# EAGLE schematic S130050_Enclosure_WD_rev_0_1 (EAGLE 6.5.0)

## Sheet 1 of 5
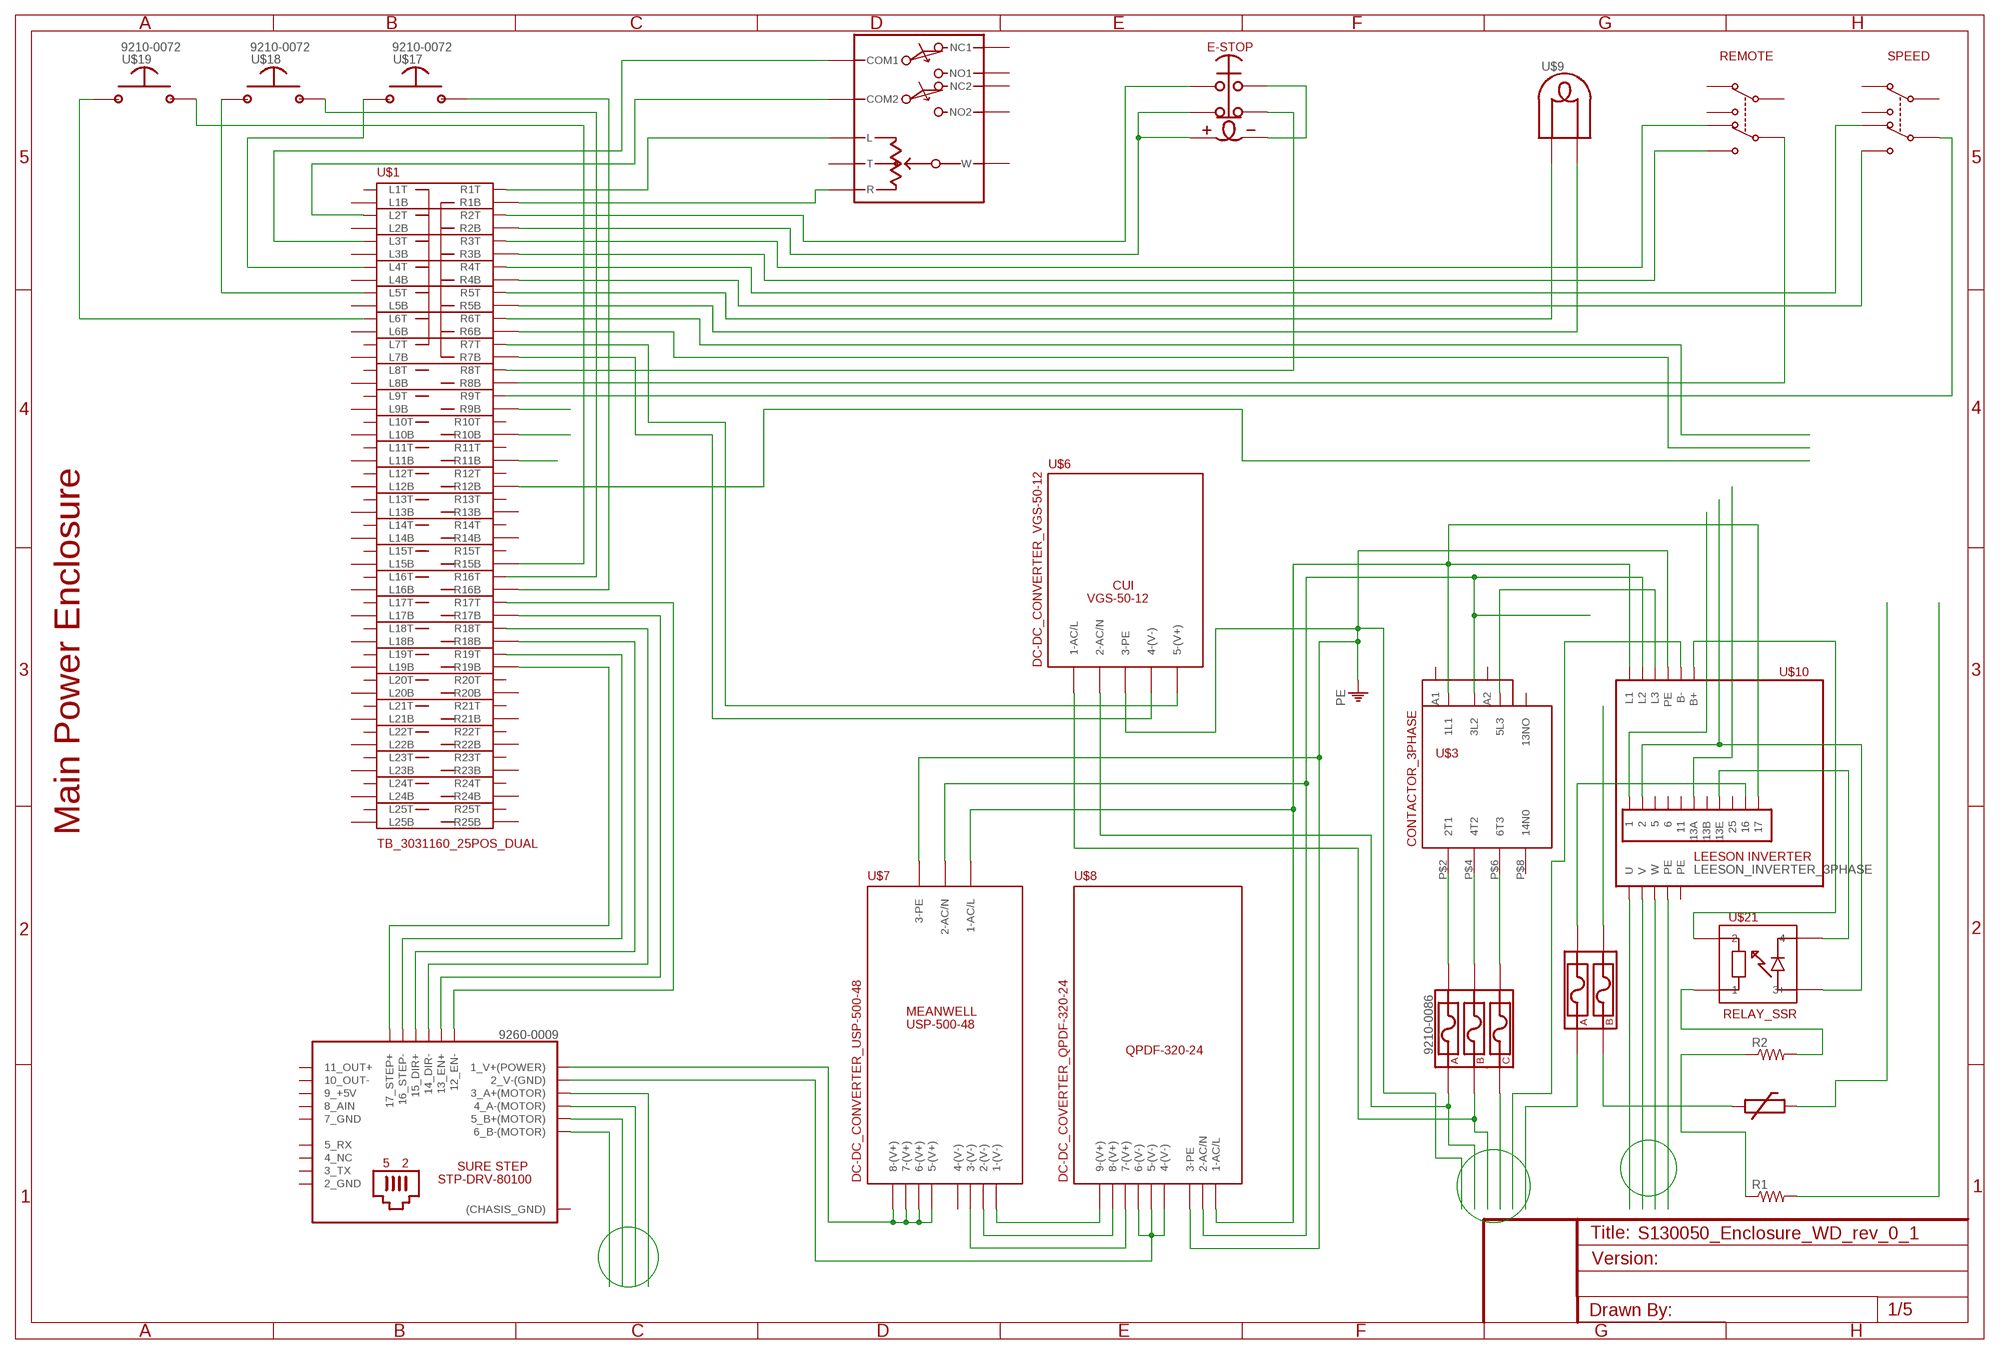
[diagram p0: schematic, sheet 1]

### Parts
R1  R-US_VTA52  [VTA52]
R2  R-US_VTA52  [VTA52]
U$1  TB_3031160_25POS_DUAL  [BOGUS]
U$2  SURE_STEP_STP-DRV-80100  [BOGUS]
U$3  CONTACTOR_3PHASE  [BOGUS]
U$4  FUSE_HOLDER_3-POLE  [BOGUS]
U$5  JOYSTICK_PRO-5  [BOGUS]
U$6  DC-DC_CONVERTER_VGS-50-12  [BOGUS]
U$7  DC-DC_CONVERTER_USP-500-48  [BOGUS]
U$8  DC-DC_COVERTER_QPDF-320-24  [BOGUS]
U$9  INDICATOR_LIGHT  [BOGUS]
U$10  LEESON_INVERTER_3PHASE  [BOGUS]
U$11  SWITCH_DPDT  [BOGUS]
U$12  THERMISTOR  [BOGUS]
U$13  SWITCH_ESTOP_LIGHTED  [BOGUS]
U$16  SWITCH_DPDT  [BOGUS]
U$17  SWITCH_MOM_NO  [BOGUS]
U$18  SWITCH_MOM_NO  [BOGUS]
U$19  SWITCH_MOM_NO  [BOGUS]
U$20  FUSE_HOLDER_2-POLE  [BOGUS]
U$21  RELAY_SSR  [BOGUS]

### Nets
B$1: U$1.P$69(R10B) U$1.P$71(R11B) U$1.P$73(R12B) ; also sheet 2
N$1: U$3.P$2(2T1) U$4.P$3
N$2: U$3.P$4(4T2) U$4.P$4
N$3: U$3.P$6(6T3) U$4.P$6
N$4: U$10.P$1
N$5: U$7.P$1(1-(V-)) U$8.P$9(9-(V+))
N$6: U$7.P$3(2-(V-)) U$8.P$8(8-(V+))
N$7: U$7.P$5(3-(V-)) U$8.P$7(7-(V+))
N$8: U$4.P$5
N$9: U$3.P$3(3L2) U$7.P$4(2-AC/N) U$8.P$2(2-AC/N) U$10.P$15(L2)
N$10: U$1.P$63(R7B) U$6.P$4(4-(V-))
N$11: U$1.P$64(R7T) U$6.P$5(5-(V+))
N$12: U$1.P$6(L3T) U$5.P$1(COM1)
N$13: U$1.P$4(L2T) U$5.P$2(COM2)
N$14: U$1.P$8(L4T) U$17.P$1
N$15: U$1.P$10(L5T) U$18.P$1
N$16: U$1.P$53(R2B) U$13.P$2 U$13.P$5
N$17: U$1.P$56(R3T) U$11.P$5
N$18: U$1.P$58(R4T) U$16.P$5
N$19: U$1.P$55(R3B) U$11.P$6
N$20: U$1.P$57(R4B) U$16.P$6
N$21: U$1.P$52(R1T) U$5.P$3(L)
N$22: U$1.P$51(R1B) U$5.P$8(R)
N$23: U$1.P$12(L6T) U$19.P$1
N$24: U$13.P$3 U$13.P$6
N$25: U$1.P$54(R2T) U$13.P$1
N$26: U$1.P$66(R8T) U$13.P$4
N$27: U$1.P$60(R5T) U$9.P$1
N$28: U$1.P$59(R5B) U$9.P$2
N$29: U$1.P$65(R8B) U$11.P$4
N$30: U$1.P$68(R9T) U$16.P$4
N$31: U$2.P$2(1_V+(POWER)) U$7.P$8(5-(V+)) U$7.P$9(6-(V+)) U$7.P$10(7-(V+)) U$7.P$11(8-(V+))
N$32: U$2.P$3(2_V-(GND)) U$8.P$4(4-(V-)) U$8.P$5(5-(V-)) U$8.P$6(6-(V-))
N$33: U$2.P$4(3_A+(MOTOR))
N$34: U$2.P$5(4_A-(MOTOR))
N$35: U$2.P$6(5_B+(MOTOR))
N$36: U$2.P$7(6_B-(MOTOR))
N$37: U$1.P$87(R19B) U$2.P$18(17_STEP+)
N$38: U$1.P$88(R19T) U$2.P$17(16_STEP-)
N$39: U$1.P$85(R18B) U$2.P$16(15_DIR+)
N$40: U$1.P$86(R18T) U$2.P$15(14_DIR-)
N$41: U$1.P$83(R17B) U$2.P$14(13_EN+)
N$42: U$1.P$84(R17T) U$2.P$13(12_EN-)
N$43: R1.2
N$44: R1.1 R2.1
N$45: U$3.P$5(5L3) U$10.P$16(L3)
N$46: U$4.P$2 U$6.P$2(2-AC/N)
N$47: U$4.P$1 U$6.P$1(1-AC/L)
N$48: U$10.P$12(B+) U$21.P$2
N$49: U$1.P$79(R15B) U$19.P$2
N$50: U$1.P$82(R16T) U$18.P$2
N$51: U$1.P$81(R16B) U$17.P$2
N$52: U$1.P$62(R6T)
N$53: U$1.P$61(R6B)
N$54: U$1.P$67(R9B)
N$55: U$10.P$20(U)
N$56: U$10.P$21(V)
N$57: U$10.P$22(W)
N$58: U$10.P$18(PE)
N$59: R2.2 U$21.P$1
N$60: U$10.P$8(13E) U$21.P$4
N$61: U$10.P$2 U$21.P$3(3+)
N$62: U$12.P$1 U$20.P$1
N$63: U$12.P$2
N$64: U$20.P$4
N$65: U$10.P$13(B-)
N$66: U$10.P$9 U$20.P$3
N$67: U$3.P$1(1L1) U$7.P$2(1-AC/L) U$8.P$1(1-AC/L) U$10.P$10 U$10.P$14(L1)
N$68: U$10.P$6(13A)
N$69: U$20.P$2
PE: U$6.P$3(3-PE) U$7.P$6(3-PE) U$8.P$3(3-PE) U$10.P$17(PE) ; also sheet 2,5
Unconnected: U$1.P$1(L1B) U$1.P$2(L1T) U$1.P$3(L2B) U$1.P$5(L3B) U$1.P$7(L4B) U$1.P$9(L5B) U$1.P$11(L6B) U$1.P$13(L7B) U$1.P$14(L7T) U$1.P$15(L8B) U$1.P$16(L8T) U$1.P$17(L9B) U$1.P$18(L9T) U$1.P$19(L10B) U$1.P$20(L10T) U$1.P$21(L11B) U$1.P$22(L11T) U$1.P$23(L12B) U$1.P$24(L12T) U$1.P$25(L13B) U$1.P$26(L13T) U$1.P$27(L14B) U$1.P$28(L14T) U$1.P$29(L15B) U$1.P$30(L15T) U$1.P$31(L16B) U$1.P$32(L16T) U$1.P$33(L17B) U$1.P$34(L17T) U$1.P$35(L18B) U$1.P$36(L18T) U$1.P$37(L19B) U$1.P$38(L19T) U$1.P$39(L20B) U$1.P$40(L20T) U$1.P$41(L21B) U$1.P$42(L21T) U$1.P$43(L22B) U$1.P$44(L22T) U$1.P$45(L23B) U$1.P$46(L23T) U$1.P$47(L24B) U$1.P$48(L24T) U$1.P$49(L25B) U$1.P$50(L25T) U$1.P$70(R10T) U$1.P$72(R11T) U$1.P$74(R12T) U$1.P$75(R13B) U$1.P$76(R13T) U$1.P$77(R14B) U$1.P$78(R14T) U$1.P$80(R15T) U$1.P$89(R20B) U$1.P$90(R20T) U$1.P$91(R21B) U$1.P$92(R21T) U$1.P$93(R22B) U$1.P$94(R22T) U$1.P$95(R23B) U$1.P$96(R23T) U$1.P$97(R24B) U$1.P$98(R24T) U$1.P$99(R25B) U$1.P$100(R25T) U$3.P$7(13NO) U$3.P$8(14N0) U$3.P$9(A1) U$3.P$10(A2) U$5.P$4(NC1) U$5.P$5(NC2) U$5.P$6(NO1) U$5.P$7(NO2) U$5.P$9(T) U$5.P$10(W) U$7.P$7(4-(V-)) U$10.P$3 U$10.P$4 U$10.P$5 U$10.P$7(13B) U$10.P$11 U$11.P$1 U$11.P$2 U$11.P$3 U$16.P$1 U$16.P$2 U$16.P$3

### Notes on the sheet
- REMOTE | SPEED
- Main Power Enclosure

## Sheet 2 of 5
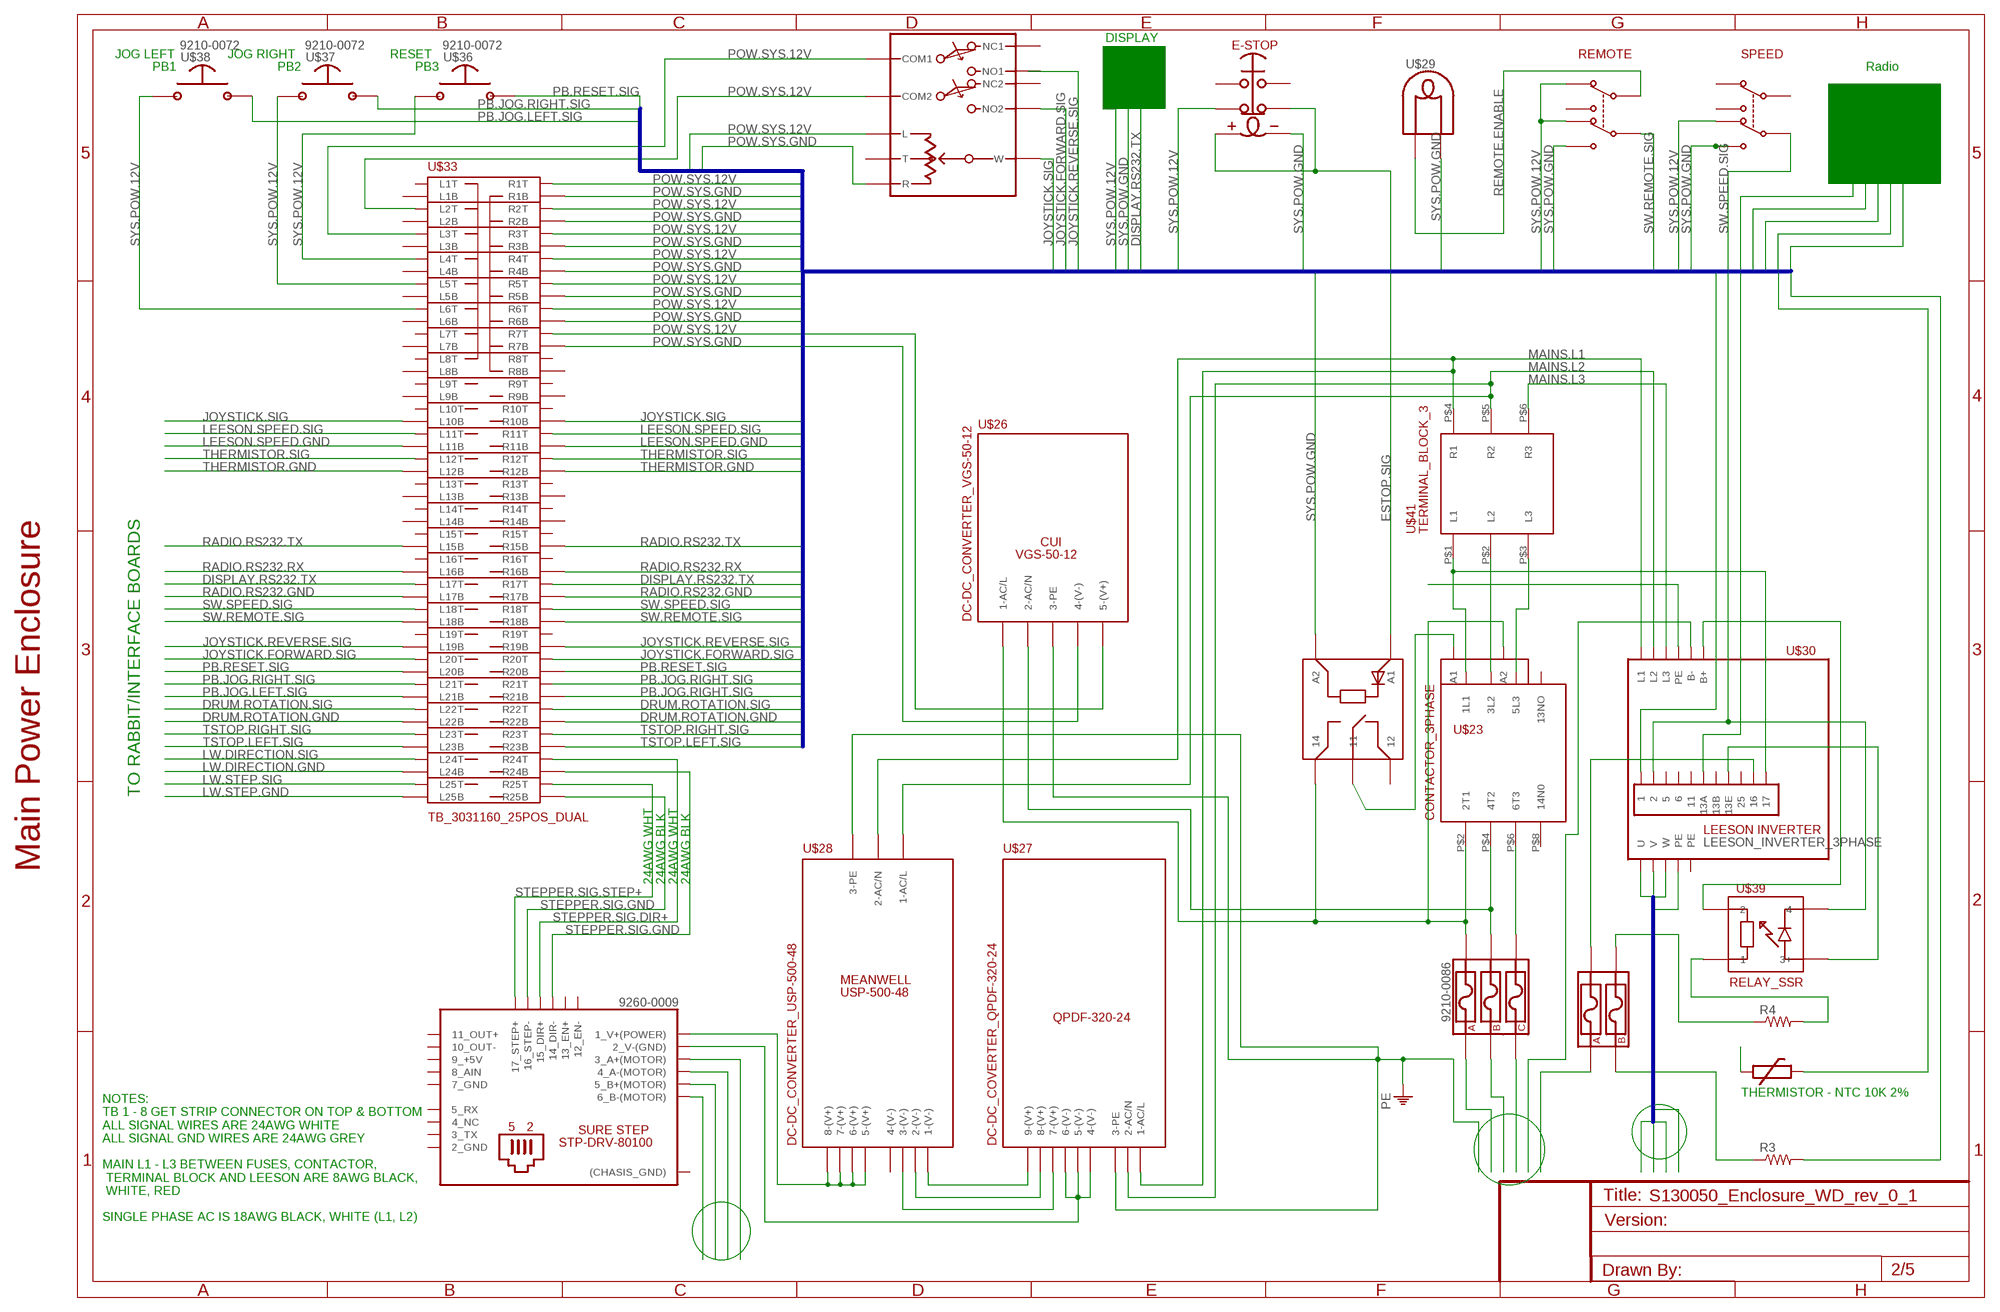
[diagram p1: schematic, sheet 2]

### Parts
R3  R-US_VTA52  [VTA52]
R4  R-US_VTA52  [VTA52]
U$22  SURE_STEP_STP-DRV-80100  [BOGUS]
U$23  CONTACTOR_3PHASE  [BOGUS]
U$24  FUSE_HOLDER_3-POLE  [BOGUS]
U$25  JOYSTICK_PRO-5  [BOGUS]
U$26  DC-DC_CONVERTER_VGS-50-12  [BOGUS]
U$27  DC-DC_COVERTER_QPDF-320-24  [BOGUS]
U$28  DC-DC_CONVERTER_USP-500-48  [BOGUS]
U$29  INDICATOR_LIGHT  [BOGUS]
U$30  LEESON_INVERTER_3PHASE  [BOGUS]
U$31  THERMISTOR  [BOGUS]
U$32  SWITCH_ESTOP_LIGHTED  [BOGUS]
U$33  TB_3031160_25POS_DUAL  [BOGUS]
U$34  SWITCH_DPDT  [BOGUS]
U$35  SWITCH_DPDT  [BOGUS]
U$36  SWITCH_MOM_NO  [BOGUS]
U$37  SWITCH_MOM_NO  [BOGUS]
U$38  SWITCH_MOM_NO  [BOGUS]
U$39  RELAY_SSR  [BOGUS]
U$40  FUSE_HOLDER_2-POLE  [BOGUS]
U$41  TERMINAL_BLOCK_3  [BOGUS]
U$42  RELAY_TB  [BOGUS]

### Nets
B$1: R3.2 U$30.P$1 U$30.P$2 U$30.P$6(13A) U$31.P$2 U$39.P$4 ; also sheet 1
B$2: U$30.P$18(PE) U$30.P$20(U) U$30.P$21(V) U$30.P$22(W)
DISPLAY.RS232.TX: U$33.P$34(L17T) U$33.P$84(R17T) ; also sheet 3,4,5
DRUM.ROTATION.GND: U$33.P$43(L22B) U$33.P$93(R22B)
DRUM.ROTATION.SIG: U$33.P$44(L22T) U$33.P$94(R22T) ; also sheet 3,4
ESTOP.SIG: U$32.P$4 U$32.P$5 U$42.P$4(A1) ; also sheet 4,5
JOYSTICK.FORWARD.SIG: U$25.P$7(NO2) U$33.P$40(L20T) U$33.P$90(R20T) ; also sheet 3,4,5
JOYSTICK.REVERSE.SIG: U$33.P$37(L19B) U$33.P$87(R19B) ; also sheet 3,4,5
JOYSTICK.SIG: U$25.P$10(W) U$33.P$19(L10B) U$33.P$69(R10B) ; also sheet 3,4,5
LEESON.SPEED.GND: U$33.P$21(L11B) U$33.P$71(R11B) ; also sheet 3,4
LEESON.SPEED.SIG: U$33.P$22(L11T) U$33.P$72(R11T) ; also sheet 3,4
LW.DIRECTION.GND: U$33.P$47(L24B)
LW.DIRECTION.SIG: U$33.P$48(L24T)
LW.STEP.GND: U$33.P$49(L25B)
LW.STEP.SIG: U$33.P$50(L25T)
MAINS.L1: U$27.P$1(1-AC/L) U$28.P$4(2-AC/N) U$30.P$14(L1) U$41.P$4(R1) ; also sheet 5
MAINS.L2: U$27.P$2(2-AC/N) U$28.P$2(1-AC/L) U$30.P$15(L2) U$41.P$5(R2) ; also sheet 5
MAINS.L3: U$30.P$16(L3) U$41.P$6(R3) ; also sheet 5
N$70: U$23.P$2(2T1) U$23.P$10(A2) U$24.P$3 U$26.P$1(1-AC/L) U$42.P$3
N$72: U$23.P$6(6T3) U$24.P$6
N$73: U$27.P$9(9-(V+)) U$28.P$1(1-(V-))
N$74: U$27.P$8(8-(V+)) U$28.P$3(2-(V-))
N$75: U$27.P$7(7-(V+)) U$28.P$5(3-(V-))
N$76: U$23.P$9(A1) U$42.P$1
N$81: R4.1 U$40.P$4
N$82: R3.1 U$40.P$1
N$83: U$31.P$1
N$84: U$23.P$3(3L2) U$41.P$2(L2)
N$88: U$30.P$17(PE)
N$93: U$23.P$1(1L1) U$30.P$10 U$41.P$1(L1)
N$94: U$23.P$5(5L3) U$41.P$3(L3)
N$95: U$24.P$2
N$96: U$24.P$1
N$98: U$22.P$2(1_V+(POWER)) U$28.P$8(5-(V+)) U$28.P$9(6-(V+)) U$28.P$10(7-(V+)) U$28.P$11(8-(V+))
N$99: U$22.P$3(2_V-(GND)) U$27.P$4(4-(V-)) U$27.P$5(5-(V-)) U$27.P$6(6-(V-))
N$100: U$22.P$4(3_A+(MOTOR))
N$101: U$22.P$5(4_A-(MOTOR))
N$102: U$22.P$6(5_B+(MOTOR))
N$103: U$22.P$7(6_B-(MOTOR))
N$111: U$23.P$4(4T2) U$24.P$4 U$26.P$2(2-AC/N)
N$123: U$24.P$5
N$125: U$30.P$12(B+) U$39.P$2
N$126: R4.2 U$39.P$1
N$128: U$30.P$8(13E) U$39.P$3(3+)
N$131: U$30.P$13(B-)
N$132: U$30.P$9 U$40.P$3
N$136: U$40.P$2
PB.JOG.LEFT.SIG: U$33.P$41(L21B) U$38.P$2 ; also sheet 3
PB.JOG.RIGHT.SIG: U$33.P$42(L21T) U$33.P$91(R21B) U$33.P$92(R21T) U$37.P$2 ; also sheet 3
PB.RESET.SIG: U$33.P$39(L20B) U$33.P$89(R20B) U$36.P$2 ; also sheet 3
PE: U$26.P$3(3-PE) U$27.P$3(3-PE) U$28.P$6(3-PE) ; also sheet 1,5
POW.SYS.12V: U$25.P$1(COM1) U$25.P$2(COM2) U$25.P$3(L) U$26.P$5(5-(V+)) U$33.P$4(L2T) U$33.P$6(L3T) U$33.P$52(R1T) U$33.P$54(R2T) U$33.P$56(R3T) U$33.P$58(R4T) U$33.P$60(R5T) U$33.P$62(R6T) U$33.P$64(R7T)
POW.SYS.GND: U$25.P$8(R) U$26.P$4(4-(V-)) U$33.P$51(R1B) U$33.P$53(R2B) U$33.P$55(R3B) U$33.P$57(R4B) U$33.P$59(R5B) U$33.P$61(R6B) U$33.P$63(R7B)
RADIO.RS232.GND: U$33.P$33(L17B) U$33.P$83(R17B) ; also sheet 4
RADIO.RS232.RX: U$33.P$31(L16B) U$33.P$81(R16B) ; also sheet 3,4,5
RADIO.RS232.TX: U$33.P$29(L15B) U$33.P$79(R15B) ; also sheet 3,4,5
REMOTE.ENABLE: U$29.P$1 U$34.P$1 ; also sheet 5
STEPPER.SIG.DIR+: U$22.P$16(15_DIR+) U$33.P$98(R24T)
STEPPER.SIG.GND: U$22.P$15(14_DIR-) U$22.P$17(16_STEP-) U$33.P$97(R24B) U$33.P$99(R25B)
STEPPER.SIG.STEP+: U$22.P$18(17_STEP+) U$33.P$100(R25T)
SW.REMOTE.SIG: U$33.P$35(L18B) U$33.P$85(R18B) U$34.P$4 ; also sheet 5
SW.SPEED.SIG: U$33.P$36(L18T) U$33.P$86(R18T) U$35.P$4 ; also sheet 5
SYS.POW.12V: U$32.P$2 U$33.P$8(L4T) U$33.P$10(L5T) U$33.P$12(L6T) U$34.P$2 U$34.P$5 U$35.P$5 U$36.P$1 U$37.P$1 U$38.P$1 ; also sheet 5
SYS.POW.GND: U$29.P$2 U$32.P$6 U$34.P$6 U$35.P$6 U$42.P$5(A2) ; also sheet 5
THERMISTOR.GND: U$33.P$23(L12B) U$33.P$73(R12B) ; also sheet 4
THERMISTOR.SIG: U$33.P$24(L12T) U$33.P$74(R12T) ; also sheet 3,4,5
TSTOP.LEFT.SIG: U$33.P$45(L23B) U$33.P$95(R23B)
TSTOP.RIGHT.SIG: U$33.P$46(L23T) U$33.P$96(R23T)
Unconnected: U$23.P$7(13NO) U$23.P$8(14N0) U$25.P$4(NC1) U$25.P$5(NC2) U$25.P$6(NO1) U$25.P$9(T) U$28.P$7(4-(V-)) U$30.P$3 U$30.P$4 U$30.P$5 U$30.P$7(13B) U$30.P$11 U$32.P$1 U$32.P$3 U$33.P$1(L1B) U$33.P$2(L1T) U$33.P$3(L2B) U$33.P$5(L3B) U$33.P$7(L4B) U$33.P$9(L5B) U$33.P$11(L6B) U$33.P$13(L7B) U$33.P$14(L7T) U$33.P$15(L8B) U$33.P$16(L8T) U$33.P$17(L9B) U$33.P$18(L9T) U$33.P$20(L10T) U$33.P$25(L13B) U$33.P$26(L13T) U$33.P$27(L14B) U$33.P$28(L14T) U$33.P$30(L15T) U$33.P$32(L16T) U$33.P$38(L19T) U$33.P$65(R8B) U$33.P$66(R8T) U$33.P$67(R9B) U$33.P$68(R9T) U$33.P$70(R10T) U$33.P$75(R13B) U$33.P$76(R13T) U$33.P$77(R14B) U$33.P$78(R14T) U$33.P$80(R15T) U$33.P$82(R16T) U$33.P$88(R19T) U$34.P$3 U$35.P$1 U$35.P$2 U$35.P$3 U$42.P$2

### Buses
B$1
B$2

### Notes on the sheet
- DISPLAY
- JOG LEFT | JOG RIGHT | RESET | REMOTE | SPEED
- PB1 | PB2 | PB3 | Radio
- TO RABBIT/INTERFACE BOARDS
- Main Power Enclosure
- 24AWG WHT | 24AWG BLK | 24AWG WHT | 24AWG BLK
- THERMISTOR - NTC 10K 2%
- NOTES:
  TB 1 - 8 GET STRIP CONNECTOR ON TOP & BOTTOM
  ALL SIGNAL WIRES ARE 24AWG WHITE
  ALL SIGNAL GND WIRES ARE 24AWG GREY
  
  MAIN L1 - L3 BETWEEN FUSES, CONTACTOR,
   TERMINAL BLOCK AND LEESON ARE 8AWG BLACK,
   WHITE, RED
  
  SINGLE PHASE AC IS 18AWG BLACK, WHITE (L1, L2)

## Sheet 3 of 5
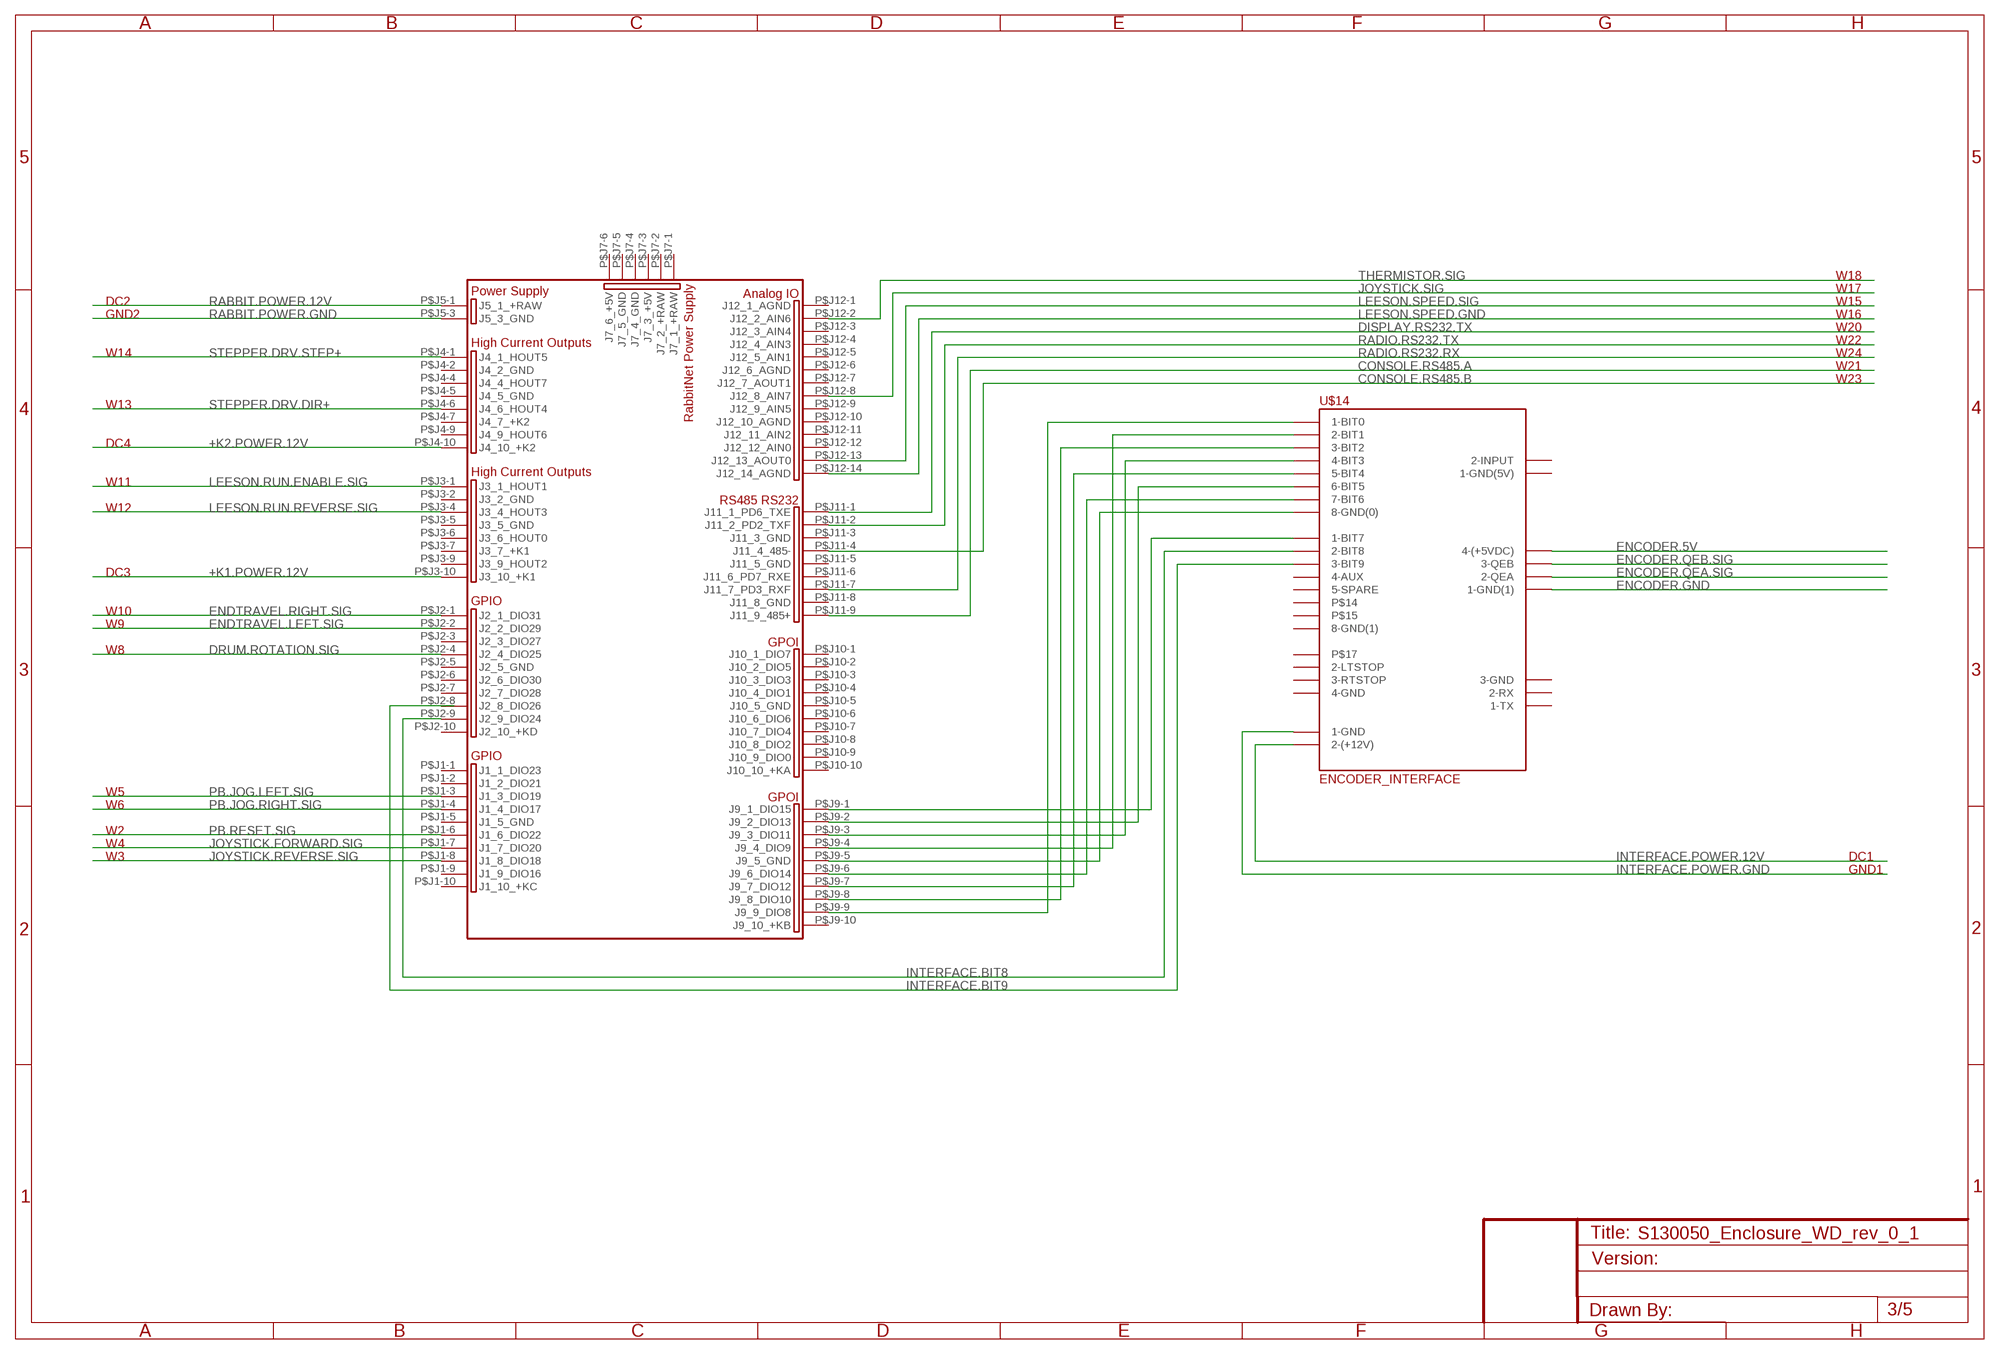
[diagram p2: schematic, sheet 3]

### Parts
U$14  ENCODER_INTERFACE  [BOGUS]
U$15  RABBIT_BL4S200(RCM4310)  [RABBIT_BL4S200]

### Nets
+K1.POWER.12V: U$15.P$J3-10(J3_10_+K1) ; also sheet 4
+K2.POWER.12V: U$15.P$J4-10(J4_10_+K2) ; also sheet 4
CONSOLE.RS485.A: U$15.P$J11-9(J11_9_485+) ; also sheet 4
CONSOLE.RS485.B: U$15.P$J11-4(J11_4_485-) ; also sheet 4
DISPLAY.RS232.TX: U$15.P$J11-1(J11_1_PD6_TXE) ; also sheet 2,4,5
DRUM.ROTATION.SIG: U$15.P$J2-4(J2_4_DIO25) ; also sheet 2,4
ENCODER.5V: U$14.P$19(4-(+5VDC))
ENCODER.GND: U$14.P$4(1-GND(1))
ENCODER.QEA.SIG: U$14.P$12(2-QEA)
ENCODER.QEB.SIG: U$14.P$17(3-QEB)
ENDTRAVEL.LEFT.SIG: U$15.P$J2-2(J2_2_DIO29) ; also sheet 4
ENDTRAVEL.RIGHT.SIG: U$15.P$J2-1(J2_1_DIO31) ; also sheet 4
INTERFACE.BIT7: U$14.P$2(1-BIT7) U$15.P$J9-1(J9_1_DIO15)
INTERFACE.BIT8: U$14.P$9(2-BIT8) U$15.P$J2-9(J2_9_DIO24)
INTERFACE.BIT9: U$14.P$15(3-BIT9)
INTERFACE.GND: U$14.P$27(8-GND(0)) U$15.P$J9-5(J9_5_GND)
INTERFACE.POWER.12V: U$14.P$7(2-(+12V)) ; also sheet 4
INTERFACE.POWER.GND: U$14.P$3(1-GND) ; also sheet 4
JOYSTICK.FORWARD.SIG: U$15.P$J1-7(J1_7_DIO20) ; also sheet 2,4,5
JOYSTICK.REVERSE.SIG: U$15.P$J1-8(J1_8_DIO18) ; also sheet 2,4,5
JOYSTICK.SIG: U$15.P$J12-8(J12_8_AIN7) ; also sheet 2,4,5
LEESON.RUN.ENABLE.SIG: U$15.P$J3-1(J3_1_HOUT1) ; also sheet 4
LEESON.RUN.REVERSE.SIG: U$15.P$J3-4(J3_4_HOUT3) ; also sheet 4
LEESON.SPEED.GND: U$15.P$J12-14(J12_14_AGND) ; also sheet 2,4
LEESON.SPEED.SIG: U$15.P$J12-13(J12_13_AOUT0) ; also sheet 2,4
N$71: U$14.P$25(6-BIT5) U$15.P$J9-2(J9_2_DIO13)
N$78: U$14.P$21(4-BIT3) U$15.P$J9-3(J9_3_DIO11)
N$79: U$14.P$8(2-BIT1) U$15.P$J9-4(J9_4_DIO9)
N$80: U$14.P$26(7-BIT6) U$15.P$J9-6(J9_6_DIO14)
N$85: U$14.P$23(5-BIT4) U$15.P$J9-7(J9_7_DIO12)
N$86: U$14.P$14(3-BIT2) U$15.P$J9-8(J9_8_DIO10)
N$90: U$14.P$1(1-BIT0) U$15.P$J9-9(J9_9_DIO8)
PB.JOG.LEFT.SIG: U$15.P$J1-3(J1_3_DIO19) ; also sheet 2
PB.JOG.RIGHT.SIG: U$15.P$J1-4(J1_4_DIO17) ; also sheet 2
PB.RESET.SIG: U$15.P$J1-6(J1_6_DIO22) ; also sheet 2
RABBIT.POWER.12V: U$15.P$J5-1(J5_1_+RAW) ; also sheet 4
RABBIT.POWER.GND: U$15.P$J5-3(J5_3_GND) ; also sheet 4
RADIO.RS232.RX: U$15.P$J11-7(J11_7_PD3_RXF) ; also sheet 2,4,5
RADIO.RS232.TX: U$15.P$J11-2(J11_2_PD2_TXF) ; also sheet 2,4,5
STEPPER.DRV.DIR+: U$15.P$J4-6(J4_6_HOUT4) ; also sheet 4,5
STEPPER.DRV.STEP+: U$15.P$J4-1(J4_1_HOUT5) ; also sheet 4,5
THERMISTOR.SIG: U$15.P$J12-2(J12_2_AIN6) ; also sheet 2,4,5
Unconnected: U$14.P$5(1-GND(5V)) U$14.P$6(1-TX) U$14.P$10(2-INPUT) U$14.P$11(2-LTSTOP) U$14.P$13(2-RX) U$14.P$16(3-GND) U$14.P$18(3-RTSTOP) U$14.P$20(4-AUX) U$14.P$22(4-GND) U$14.P$24(5-SPARE) U$14.P$29 U$14.P$30 U$14.P$31 U$15.P$J1-1(J1_1_DIO23) U$15.P$J1-2(J1_2_DIO21) U$15.P$J1-5(J1_5_GND) U$15.P$J1-9(J1_9_DIO16) U$15.P$J1-10(J1_10_+KC) U$15.P$J2-3(J2_3_DIO27) U$15.P$J2-5(J2_5_GND) U$15.P$J2-6(J2_6_DIO30) U$15.P$J2-7(J2_7_DIO28) U$15.P$J2-8(J2_8_DIO26) U$15.P$J2-10(J2_10_+KD) U$15.P$J3-2(J3_2_GND) U$15.P$J3-5(J3_5_GND) U$15.P$J3-6(J3_6_HOUT0) U$15.P$J3-7(J3_7_+K1) U$15.P$J3-9(J3_9_HOUT2) U$15.P$J4-2(J4_2_GND) U$15.P$J4-4(J4_4_HOUT7) U$15.P$J4-5(J4_5_GND) U$15.P$J4-7(J4_7_+K2) U$15.P$J4-9(J4_9_HOUT6) U$15.P$J7-1(J7_1_+RAW) U$15.P$J7-2(J7_2_+RAW) U$15.P$J7-3(J7_3_+5V) U$15.P$J7-4(J7_4_GND) U$15.P$J7-5(J7_5_GND) U$15.P$J7-6(J7_6_+5V) U$15.P$J9-10(J9_10_+KB) U$15.P$J10-1(J10_1_DIO7) U$15.P$J10-2(J10_2_DIO5) U$15.P$J10-3(J10_3_DIO3) U$15.P$J10-4(J10_4_DIO1) U$15.P$J10-5(J10_5_GND) U$15.P$J10-6(J10_6_DIO6) U$15.P$J10-7(J10_7_DIO4) U$15.P$J10-8(J10_8_DIO2) U$15.P$J10-9(J10_9_DIO0) U$15.P$J10-10(J10_10_+KA) U$15.P$J11-3(J11_3_GND) U$15.P$J11-5(J11_5_GND) U$15.P$J11-6(J11_6_PD7_RXE) U$15.P$J11-8(J11_8_GND) U$15.P$J12-1(J12_1_AGND) U$15.P$J12-3(J12_3_AIN4) U$15.P$J12-4(J12_4_AIN3) U$15.P$J12-5(J12_5_AIN1) U$15.P$J12-6(J12_6_AGND) U$15.P$J12-7(J12_7_AOUT1) U$15.P$J12-9(J12_9_AIN5) U$15.P$J12-10(J12_10_AGND) U$15.P$J12-11(J12_11_AIN2) U$15.P$J12-12(J12_12_AIN0)

### Notes on the sheet
- W18
- W17
- DC2 | W15
- GND2 | W16
- W20
- W22
- W14 | W24
- W21
- W23
- W13
- DC4
- W11
- W12
- DC3
- W10
- W9
- W8
- W5
- W6
- W2
- W4
- W3 | DC1
- GND1

## Sheet 4 of 5
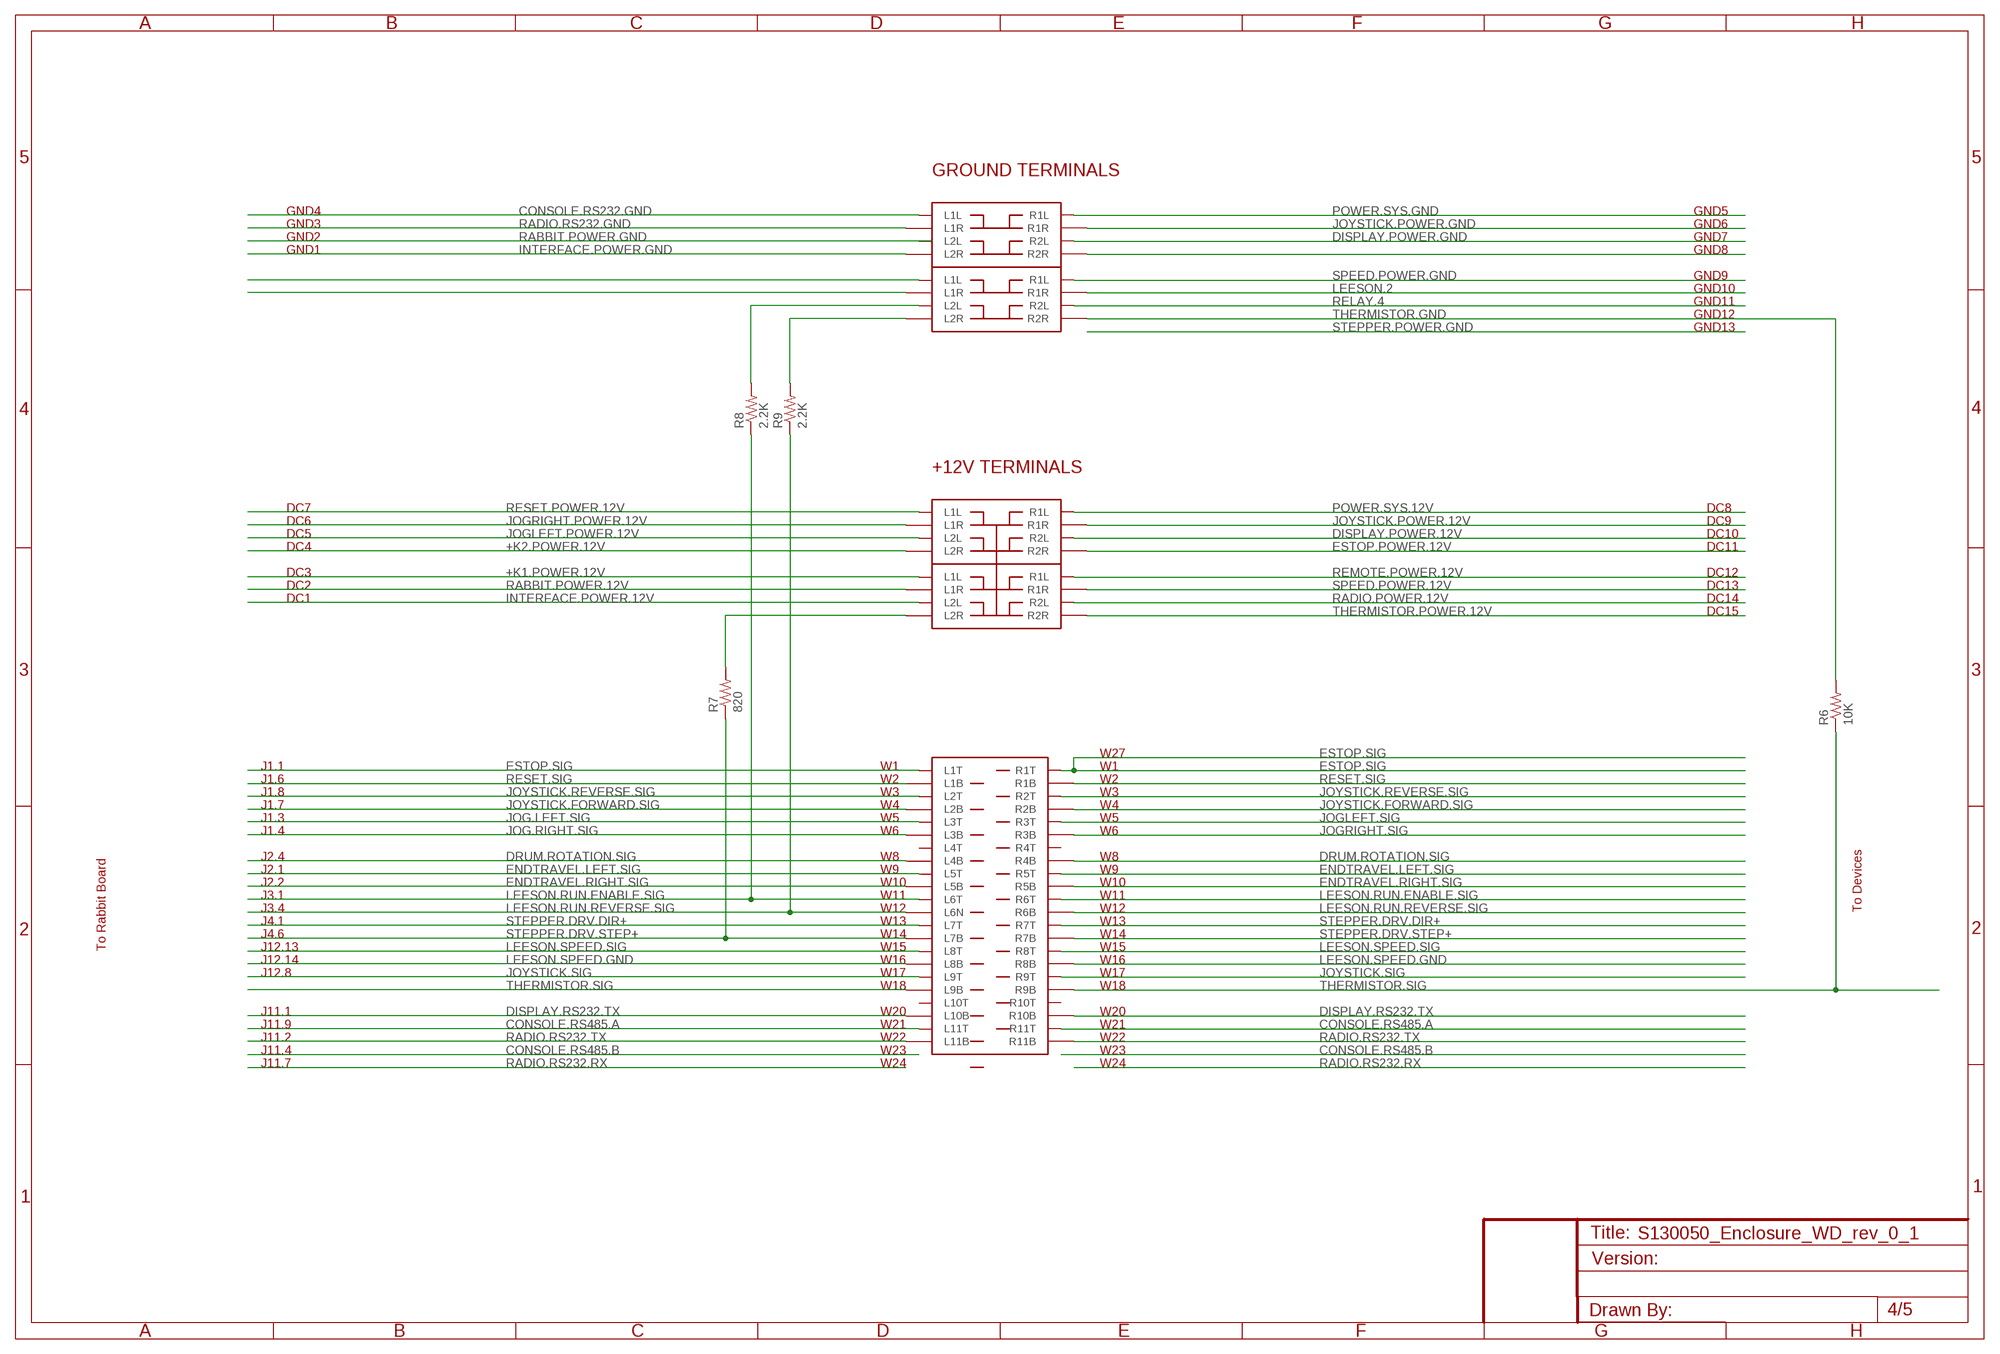
[diagram p3: schematic, sheet 4]

### Parts
R6  10K  R-US_V235/17  [V235/17]
R7  820  R-US_V235/17  [V235/17]
R8  2.2K  R-US_V235/17  [V235/17]
R9  2.2K  R-US_V235/17  [V235/17]
U$43  TB_3031160_11POS_DUAL_2  [BOGUS]
U$44  TB_3XXXXXX_4X_2POS  [BOGUS]
U$45  TB_3XXXXXX_4X_2POS  [BOGUS]
U$46  TB_3XXXXXX_4X_2POS  [BOGUS]
U$47  TB_3XXXXXX_4X_2POS  [BOGUS]

### Nets
+K1.POWER.12V: U$44.P$1(L1L) ; also sheet 3
+K2.POWER.12V: U$45.P$4(L2R) ; also sheet 3
CONSOLE.RS232.GND: U$47.P$1(L1L)
CONSOLE.RS485.A: U$43.P$22(L11T) U$43.P$44(R11T) ; also sheet 3
DISPLAY.POWER.12V: U$45.P$7(R2L)
DISPLAY.POWER.GND: U$47.P$7(R2L)
DISPLAY.RS232.TX: U$43.P$19(L10B) U$43.P$41(R10B) ; also sheet 2,3,5
DRUM.ROTATION.SIG: U$43.P$7(L4B) U$43.P$29(R4B) ; also sheet 2,3
ENDTRAVEL.LEFT.SIG: U$43.P$10(L5T) U$43.P$32(R5T) ; also sheet 3
ENDTRAVEL.RIGHT.SIG: U$43.P$9(L5B) U$43.P$31(R5B) ; also sheet 3
ESTOP.POWER.12V: U$45.P$8(R2R)
ESTOP.SIG: U$43.P$2(L1T) U$43.P$24(R1T) ; also sheet 2,5
INTERFACE.POWER.12V: U$44.P$3(L2L) ; also sheet 3
INTERFACE.POWER.GND: U$47.P$4(L2R) ; also sheet 3
JOG.LEFT.SIG: U$43.P$6(L3T)
JOG.RIGHT.SIG: U$43.P$5(L3B)
JOGLEFT.POWER.12V: U$45.P$3(L2L) ; also sheet 5
JOGLEFT.SIG: U$43.P$28(R3T) ; also sheet 5
JOGRIGHT.POWER.12V: U$45.P$2(L1R) ; also sheet 5
JOGRIGHT.SIG: U$43.P$27(R3B) ; also sheet 5
JOYSTICK.FORWARD.SIG: U$43.P$3(L2B) U$43.P$25(R2B) ; also sheet 2,3,5
JOYSTICK.POWER.12V: U$45.P$6(R1R) ; also sheet 5
JOYSTICK.POWER.GND: U$47.P$6(R1R) ; also sheet 5
JOYSTICK.REVERSE.SIG: U$43.P$4(L2T) U$43.P$26(R2T) ; also sheet 2,3,5
JOYSTICK.SIG: U$43.P$18(L9T) U$43.P$40(R9T) ; also sheet 2,3,5
LEESON.2: U$46.P$6(R1R) ; also sheet 5
LEESON.RUN.ENABLE.SIG: R8.1 U$43.P$12(L6T) U$43.P$34(R6T) ; also sheet 3
LEESON.RUN.REVERSE.SIG: R9.1 U$43.P$11(L6N) U$43.P$33(R6B) ; also sheet 3
LEESON.SPEED.GND: U$43.P$15(L8B) U$43.P$37(R8B) ; also sheet 2,3
LEESON.SPEED.SIG: U$43.P$16(L8T) U$43.P$38(R8T) ; also sheet 2,3
N$77: U$47.P$8(R2R)
N$104: U$46.P$1(L1L)
N$105: U$46.P$2(L1R)
N$106: R8.2 U$46.P$3(L2L)
N$107: R9.2 U$46.P$4(L2R)
N$117: R7.2 U$44.P$4(L2R)
POWER.SYS.12V: U$45.P$5(R1L) ; also sheet 5
POWER.SYS.GND: U$47.P$5(R1L) ; also sheet 5
RABBIT.POWER.12V: U$44.P$2(L1R) ; also sheet 3
RADIO.POWER.12V: U$44.P$7(R2L) ; also sheet 5
RADIO.RS232.GND: U$47.P$2(L1R) ; also sheet 2
RADIO.RS232.TX: U$43.P$21(L11B) U$43.P$43(R11B) ; also sheet 2,3,5
RELAY.4: U$46.P$7(R2L) ; also sheet 5
REMOTE.POWER.12V: U$44.P$5(R1L)
RESET.POWER.12V: U$45.P$1(L1L) ; also sheet 5
RESET.SIG: U$43.P$1(L1B) U$43.P$23(R1B) ; also sheet 5
SPEED.POWER.12V: U$44.P$6(R1R)
SPEED.POWER.GND: U$46.P$5(R1L)
STEPPER.DRV.DIR+: U$43.P$14(L7T) U$43.P$36(R7T) ; also sheet 3,5
STEPPER.DRV.STEP+: R7.1 U$43.P$13(L7B) U$43.P$35(R7B) ; also sheet 3,5
THERMISTOR.GND: R6.2 U$46.P$8(R2R) ; also sheet 2
THERMISTOR.POWER.12V: U$44.P$8(R2R) ; also sheet 5
THERMISTOR.SIG: R6.1 U$43.P$17(L9B) U$43.P$39(R9B) ; also sheet 2,3,5
Unconnected: U$43.P$8(L4T) U$43.P$20(L10T) U$43.P$30(R4T) U$43.P$42(R10T) U$47.P$3(L2L)

### Notes on the sheet
- GROUND TERMINALS
- GND4 | GND5
- GND3 | GND6
- GND2 | GND7
- GND1 | GND8
- GND9
- GND10
- GND11
- GND12
- GND13
- +12V TERMINALS
- DC7 | DC8
- DC6 | DC9
- DC5 | DC10
- DC4 | DC11
- DC3 | DC12
- DC2 | DC13
- DC1 | DC14
- DC15
- W27
- J1.1 | W1 | W1
- J1.6 | W2 | W2
- J1.8 | W3 | W3
- J1.7 | W4 | W4
- J1.3 | W5 | W5
- J1.4 | W6 | W6
- J2.4 | W8 | W8
- J2.1 | W9 | W9
- J2.2 | W10 | W10
- J3.1 | W11 | W11
- J3.4 | W12 | W12 | To Devices
- J4.1 | W13 | W13
- J4.6 | W14 | W14
- To Rabbit Board | J12.13 | W15 | W15
- J12.14 | W16 | W16
- J12.8 | W17 | W17
- W18 | W18
- J11.1 | W20 | W20
- J11.9 | W21 | W21
- J11.2 | W22 | W22
- J11.4 | W23 | W23
- J11.7 | W24 | W24

## Sheet 5 of 5
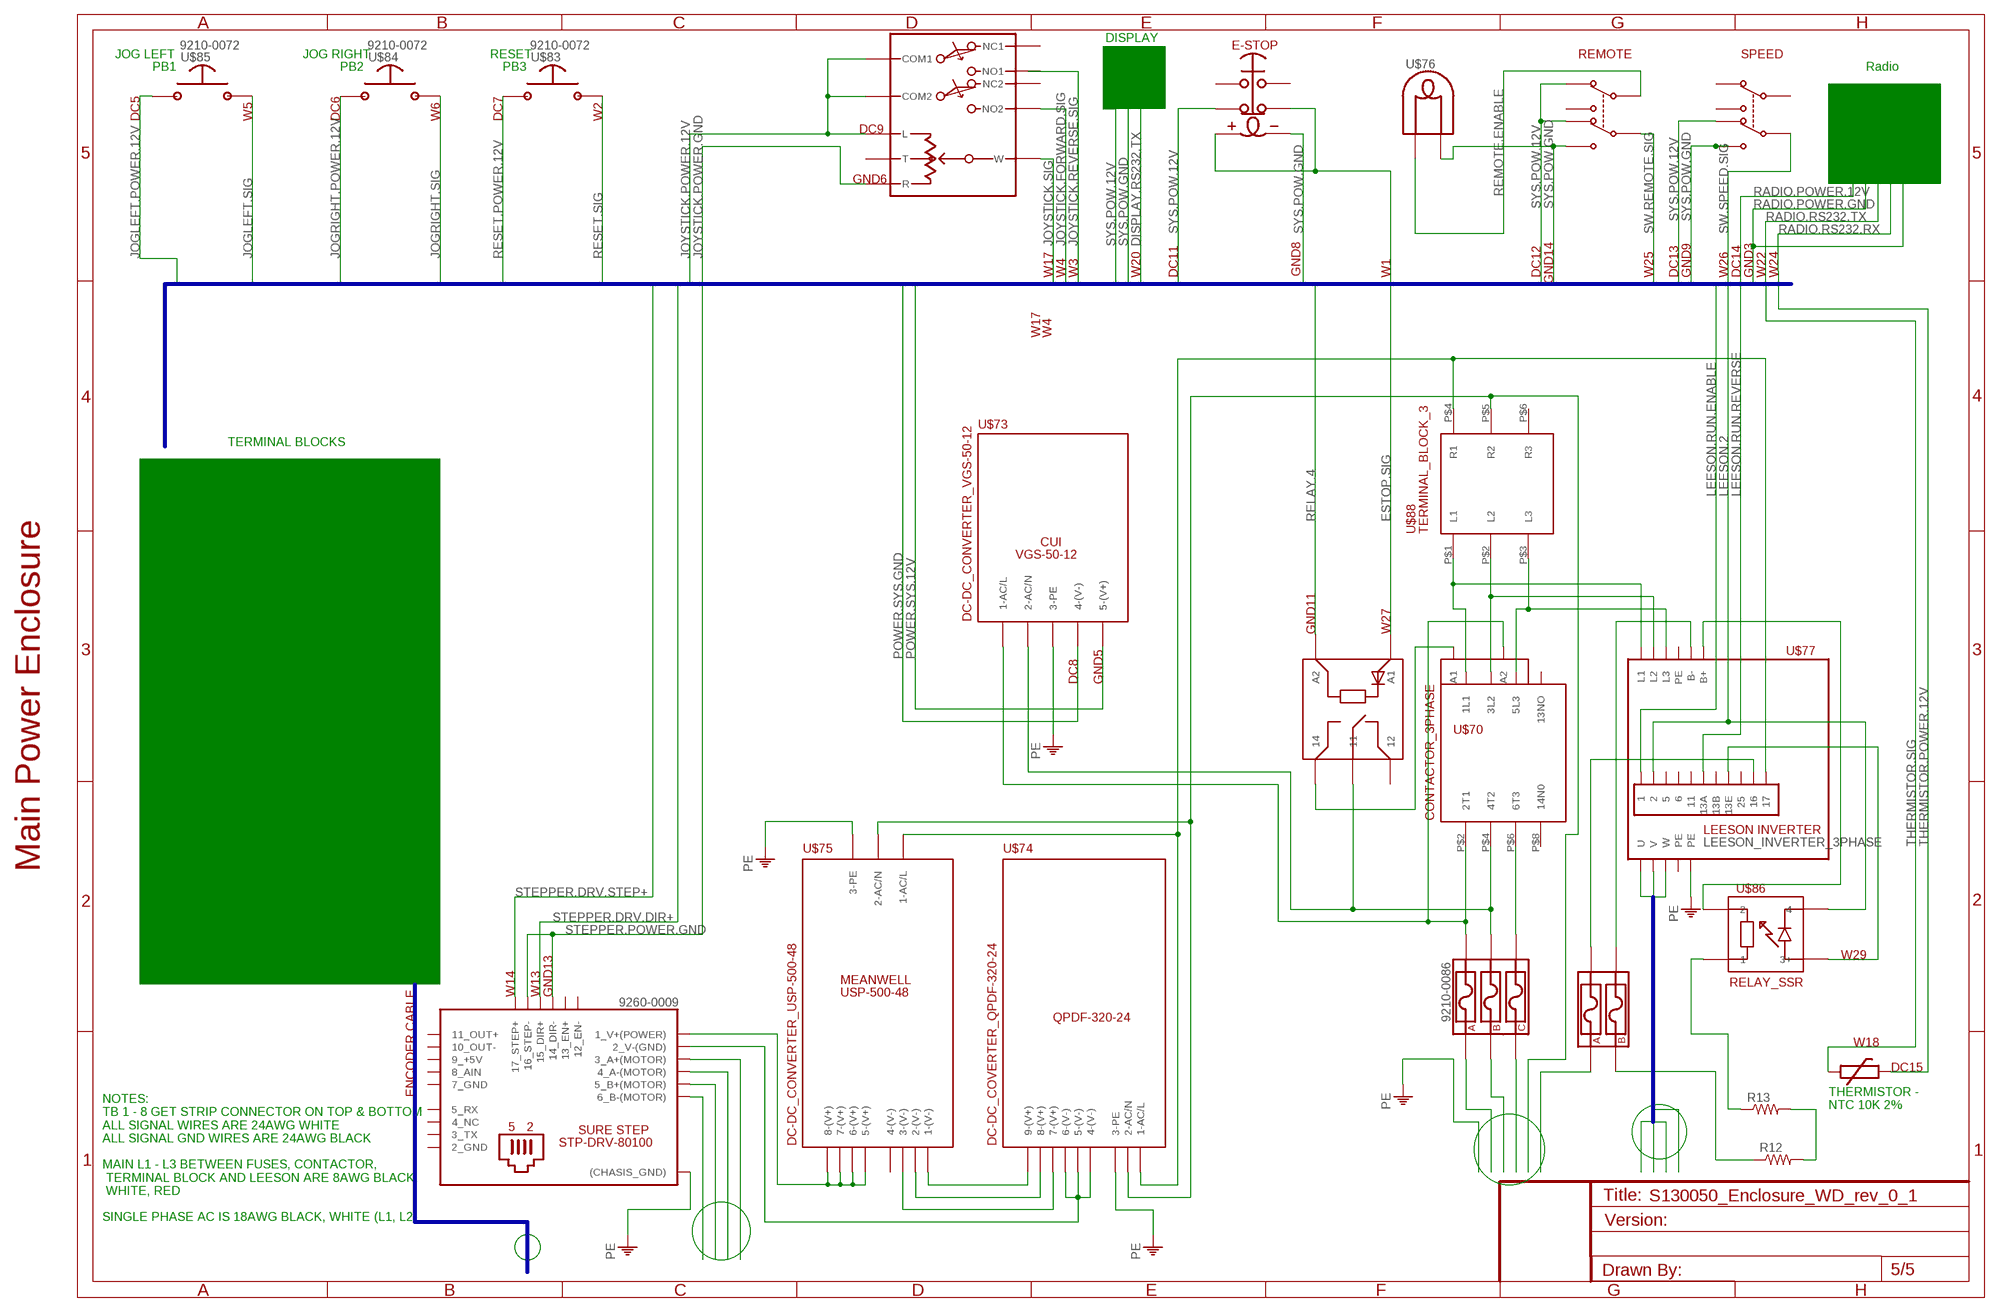
[diagram p4: schematic, sheet 5]

### Parts
R12  R-US_VTA52  [VTA52]
R13  R-US_VTA52  [VTA52]
U$69  SURE_STEP_STP-DRV-80100  [BOGUS]
U$70  CONTACTOR_3PHASE  [BOGUS]
U$71  FUSE_HOLDER_3-POLE  [BOGUS]
U$72  JOYSTICK_PRO-5  [BOGUS]
U$73  DC-DC_CONVERTER_VGS-50-12  [BOGUS]
U$74  DC-DC_COVERTER_QPDF-320-24  [BOGUS]
U$75  DC-DC_CONVERTER_USP-500-48  [BOGUS]
U$76  INDICATOR_LIGHT  [BOGUS]
U$77  LEESON_INVERTER_3PHASE  [BOGUS]
U$78  THERMISTOR  [BOGUS]
U$79  SWITCH_ESTOP_LIGHTED  [BOGUS]
U$81  SWITCH_DPDT  [BOGUS]
U$82  SWITCH_DPDT  [BOGUS]
U$83  SWITCH_MOM_NO  [BOGUS]
U$84  SWITCH_MOM_NO  [BOGUS]
U$85  SWITCH_MOM_NO  [BOGUS]
U$86  RELAY_SSR  [BOGUS]
U$87  FUSE_HOLDER_2-POLE  [BOGUS]
U$88  TERMINAL_BLOCK_3  [BOGUS]
U$89  RELAY_TB  [BOGUS]

### Nets
B$5: U$77.P$20(U) U$77.P$21(V) U$77.P$22(W)
ESTOP.SIG: U$79.P$4 U$79.P$5 U$89.P$4(A1) ; also sheet 2,4
JOGLEFT.POWER.12V: U$85.P$1 ; also sheet 4
JOGLEFT.SIG: U$85.P$2 ; also sheet 4
JOGRIGHT.POWER.12V: U$84.P$1 ; also sheet 4
JOGRIGHT.SIG: U$84.P$2 ; also sheet 4
JOYSTICK.FORWARD.SIG: U$72.P$7(NO2) ; also sheet 2,3,4
JOYSTICK.POWER.12V: U$72.P$1(COM1) U$72.P$2(COM2) U$72.P$3(L) ; also sheet 4
JOYSTICK.POWER.GND: U$72.P$8(R) ; also sheet 4
JOYSTICK.SIG: U$72.P$10(W) ; also sheet 2,3,4
LEESON.2: U$77.P$2 U$86.P$4 ; also sheet 4
LEESON.RUN.ENABLE: U$77.P$1
LEESON.RUN.REVERSE: U$77.P$6(13A)
MAINS.L1: U$74.P$1(1-AC/L) U$75.P$2(1-AC/L) U$77.P$10 U$88.P$4(R1) ; also sheet 2
MAINS.L2: U$74.P$2(2-AC/N) U$75.P$4(2-AC/N) U$88.P$5(R2) ; also sheet 2
MAINS.L3: U$70.P$5(5L3) U$77.P$16(L3) U$88.P$3(L3) ; also sheet 2
N$87: U$70.P$9(A1) U$89.P$3
N$89: U$70.P$1(1L1) U$77.P$14(L1) U$88.P$1(L1)
N$91: U$70.P$3(3L2) U$77.P$15(L2) U$88.P$2(L2)
N$92: R13.1 U$86.P$1
N$97: U$77.P$13(B-) U$87.P$4
N$108: R12.2 R13.2
N$141: U$70.P$2(2T1) U$70.P$10(A2) U$71.P$3 U$73.P$1(1-AC/L)
N$142: U$70.P$6(6T3) U$71.P$6
N$143: U$74.P$9(9-(V+)) U$75.P$1(1-(V-))
N$144: U$74.P$8(8-(V+)) U$75.P$3(2-(V-))
N$145: U$74.P$7(7-(V+)) U$75.P$5(3-(V-))
N$146: U$69.P$2(1_V+(POWER)) U$75.P$8(5-(V+)) U$75.P$9(6-(V+)) U$75.P$10(7-(V+)) U$75.P$11(8-(V+))
N$147: U$69.P$3(2_V-(GND)) U$74.P$4(4-(V-)) U$74.P$5(5-(V-)) U$74.P$6(6-(V-))
N$148: U$69.P$4(3_A+(MOTOR))
N$149: U$69.P$5(4_A-(MOTOR))
N$150: U$69.P$6(5_B+(MOTOR))
N$151: U$69.P$7(6_B-(MOTOR))
N$152: U$70.P$4(4T2) U$71.P$4 U$73.P$2(2-AC/N) U$89.P$1
N$153: U$71.P$5
N$154: U$77.P$12(B+) U$86.P$2
N$156: U$77.P$8(13E) U$86.P$3(3+)
N$158: U$77.P$9 U$87.P$3
N$159: U$87.P$2
N$161: R12.1 U$87.P$1
N$166: U$71.P$2
N$167: U$71.P$1
PE: U$69.P$1((CHASIS_GND)) U$73.P$3(3-PE) U$74.P$3(3-PE) U$75.P$6(3-PE) U$77.P$19(PE) ; also sheet 1,2
POWER.SYS.12V: U$73.P$5(5-(V+)) ; also sheet 4
POWER.SYS.GND: U$73.P$4(4-(V-)) ; also sheet 4
RELAY.4: U$89.P$5(A2) ; also sheet 4
REMOTE.ENABLE: U$76.P$1 U$81.P$1 ; also sheet 2
RESET.POWER.12V: U$83.P$1 ; also sheet 4
RESET.SIG: U$83.P$2 ; also sheet 4
STEPPER.DRV.DIR+: U$69.P$16(15_DIR+) ; also sheet 3,4
STEPPER.DRV.STEP+: U$69.P$18(17_STEP+) ; also sheet 3,4
STEPPER.POWER.GND: U$69.P$15(14_DIR-) U$69.P$17(16_STEP-) ; also sheet 4
SW.REMOTE.SIG: U$81.P$4 ; also sheet 2
SW.SPEED.SIG: U$82.P$4 ; also sheet 2
SYS.POW.12V: U$79.P$2 U$81.P$2 U$81.P$5 U$82.P$5 ; also sheet 2
SYS.POW.GND: U$76.P$2 U$79.P$6 U$81.P$6 U$82.P$6 ; also sheet 2
THERMISTOR.POWER.12V: U$78.P$2 ; also sheet 4
THERMISTOR.SIG: U$78.P$1 ; also sheet 2,3,4
Unconnected: U$70.P$7(13NO) U$70.P$8(14N0) U$72.P$4(NC1) U$72.P$5(NC2) U$72.P$6(NO1) U$72.P$9(T) U$75.P$7(4-(V-)) U$77.P$3 U$77.P$4 U$77.P$5 U$77.P$7(13B) U$77.P$11 U$79.P$1 U$79.P$3 U$81.P$3 U$82.P$1 U$82.P$2 U$82.P$3 U$88.P$6(R3) U$89.P$2

### Buses
B$1
B$2
B$3

### Notes on the sheet
- DISPLAY
- JOG LEFT | JOG RIGHT | RESET | REMOTE | SPEED
- PB1 | PB2 | PB3 | Radio
- DC5 | W5 | DC6 | W6 | DC7 | W2
- DC9
- GND6
- W17 | W4 | W3 | W20 | DC11 | GND8 | W1 | DC12 | W25 | DC13 | GND9 | W26 | DC14 | GND3 | W22 | W24
- GND14
- W17 | W4
- TERMINAL BLOCKS
- GND11 | W27
- DC8 | GND5
- Main Power Enclosure
- W29
- W14 | W13 | GND13
- W18
- DC15
- ENCODER CABLE
- THERMISTOR - 
  NTC 10K 2%
- NOTES:
  TB 1 - 8 GET STRIP CONNECTOR ON TOP & BOTTOM
  ALL SIGNAL WIRES ARE 24AWG WHITE
  ALL SIGNAL GND WIRES ARE 24AWG BLACK
  
  MAIN L1 - L3 BETWEEN FUSES, CONTACTOR,
   TERMINAL BLOCK AND LEESON ARE 8AWG BLACK,
   WHITE, RED
  
  SINGLE PHASE AC IS 18AWG BLACK, WHITE (L1, L2)

## Power pins joined to a net without a drawn wire
2_GND: U$2.P$19(2_GND) U$22.P$19(2_GND) U$69.P$19(2_GND)
3_TX: U$2.P$20(3_TX) U$22.P$20(3_TX) U$69.P$20(3_TX)
4_NC: U$2.P$21(4_NC) U$22.P$21(4_NC) U$69.P$21(4_NC)
5_RX: U$2.P$22(5_RX) U$22.P$22(5_RX) U$69.P$22(5_RX)
7_GND: U$2.P$8(7_GND) U$22.P$8(7_GND) U$69.P$8(7_GND)
8-GND(1): U$14.P$28(8-GND(1))
8_AIN: U$2.P$9(8_AIN) U$22.P$9(8_AIN) U$69.P$9(8_AIN)
9_+5V: U$2.P$10(9_+5V) U$22.P$10(9_+5V) U$69.P$10(9_+5V)
10_OUT-: U$2.P$11(10_OUT-) U$22.P$11(10_OUT-) U$69.P$11(10_OUT-)
11_OUT+: U$2.P$12(11_OUT+) U$22.P$12(11_OUT+) U$69.P$12(11_OUT+)
12_EN-: U$22.P$13(12_EN-) U$69.P$13(12_EN-)
13_EN+: U$22.P$14(13_EN+) U$69.P$14(13_EN+)
(CHASIS_GND): U$2.P$1((CHASIS_GND)) U$22.P$1((CHASIS_GND))
PE: U$10.P$19(PE) U$30.P$19(PE) U$77.P$17(PE) U$77.P$18(PE)

## Library data of the parts
R1-R4 R12 R13 = rcl:R-US_: RESISTOR, American symbol
R6-R9 = resistor:R-US_: RESISTOR, American symbol
U$1 U$33 = SOSI-TerminalBlocks:TB_3031160_25POS_DUAL
U$2 U$22 U$69 = DougM-SOSI-Wiring-Diagram.rpt:SURE_STEP_STP-DRV-80100: 9260-0009 STP-DRV-80100 Step Motor Driver, 80 V 10A Sure Step Automation Direct
U$3 U$23 U$70 = DougM-SOSI-Wiring-Diagram.rpt:CONTACTOR_3PHASE
U$4 U$24 U$71 = DougM-SOSI-Wiring-Diagram.rpt:FUSE_HOLDER_3-POLE: 9210-0086 BC6033PQ Fuseholder, Class CC & Class G, 3 pole, 600V, 30A, for 13/32x1 1/2 fuses Cooper/Bussman North Coast Electric
U$5 U$25 U$72 = DougM-SOSI-Wiring-Diagram.rpt:JOYSTICK_PRO-5: 9280-0000 PRO5-202.1085 (w/20k center tap potentiometer) Joystick (Master Switch), w/20k center tap potentiometer J. R. Merritt Controls
U$6 U$26 U$73 = DougM-SOSI-Wiring-Diagram.rpt:DC-DC_CONVERTER_VGS-50-12
U$7 U$28 U$75 = DougM-SOSI-Wiring-Diagram.rpt:DC-DC_CONVERTER_USP-500-48
U$8 U$27 U$74 = DougM-SOSI-Wiring-Diagram.rpt:DC-DC_COVERTER_QPDF-320-24
U$9 U$29 U$76 = DougM-SOSI-Wiring-Diagram.rpt:INDICATOR_LIGHT: 9210-0341 OMPBD7D-P3N3 Indicator Light, LED, Complete Asssembly, 22.5mm, IP66, 24V AC/DC Omega www.omega.com
U$10 U$30 U$77 = DougM-SOSI-Wiring-Diagram.rpt:LEESON_INVERTER_3PHASE
U$11 U$16 U$34 U$35 U$81 U$82 = DougM-SOSI-Wiring-Diagram.rpt:SWITCH_DPDT: 9210-0123 Switch, Non-Illuminated, 30.5mm, Type 4/4x/13, 2 Pos. Selector, Std. Knob Maint, 1 N.O.-1 N.C., WHITE 9210-0175?? Switch, Selector, 2-Position, Maintained, Blk handle w/ wht insert (old #800H-24HRAH2KB6AX)
U$12 U$31 U$78 = DougM-SOSI-Wiring-Diagram.rpt:THERMISTOR: (no PN available) (no description available) Soundnine Inc. (no vendor PN available)
U$13 U$32 U$79 = DougM-SOSI-Wiring-Diagram.rpt:SWITCH_ESTOP_LIGHTED: 9210-0045 Switch, Emergency Stop, w/ #800T-XA4 contact block (old #800H-FRXTQH10RA4) Allen Bradley 800H-FRXTQH2RA4
U$14 = DougM-SOSI-Wiring-Diagram.rpt:ENCODER_INTERFACE
U$15 = DougM.SOSI.Microcontroller:RABBIT_BL4S200(RCM4310): 9210-0442 COMPUTER SINGLE-BOARD BL4S200 Rabbit Semiconductor 20-101-1220 Digi-Key 316-1164-ND
U$17-U$19 U$36-U$38 U$83-U$85 = DougM-SOSI-Wiring-Diagram.rpt:SWITCH_MOM_NO: 9210-0072 Mouser Part #: 850-59-313 Manufacturer Part #: 59-313
U$20 U$40 U$87 = DougM-SOSI-Wiring-Diagram.rpt:FUSE_HOLDER_2-POLE: 9210-0047 Cooper/Bussman BM6032SQ 9210-0194 Cooper/Bussman BK/S-8301-2-R
U$21 U$39 U$86 = DougM-SOSI-Wiring-Diagram.rpt:RELAY_SSR
U$41 U$88 = DougM-SOSI-Wiring-Diagram.rpt:TERMINAL_BLOCK_3
U$42 U$89 = DougM-SOSI-Wiring-Diagram.rpt:RELAY_TB
U$43 = SOSI-TerminalBlocks:TB_3031160_11POS_DUAL_2
U$44-U$47 = SOSI-TerminalBlocks:TB_3XXXXXX_4X_2POS